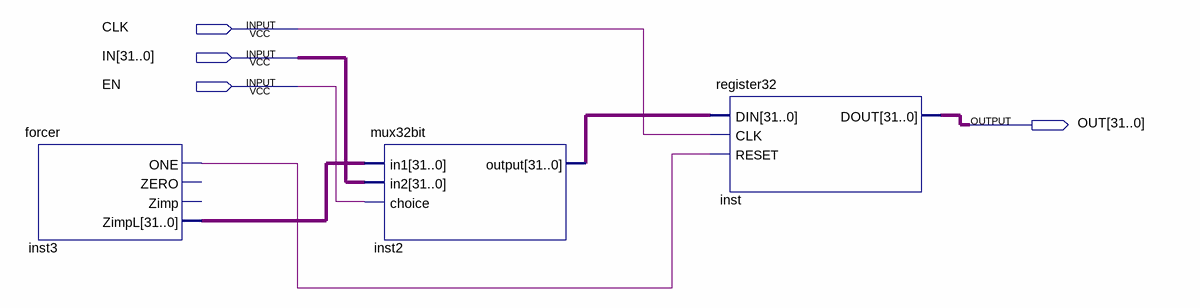
[diagram p0: schematic sheet]
// Quartus schematic BufferControl.bdf as structural Verilog: 3 symbols, 4 pins
module BufferControl (
  input  CLK,
  input  [31:0] IN,
  input  EN,
  output [31:0] OUT
);

  wire inst3_one;
  wire [31:0] inst2_output, inst3_zimpl;

  forcer inst3 (.ONE(inst3_one), .ZimpL(inst3_zimpl));  // open: ZERO, Zimp
  mux32bit inst2 (.in1(inst3_zimpl), .in2(IN), .choice(EN), .\output (inst2_output));
  register32 inst (.DIN(inst2_output), .CLK(CLK), .RESET(inst3_one), .DOUT(OUT));
endmodule
